# Altium schematic sheet Test_shema.SchDoc
size A4
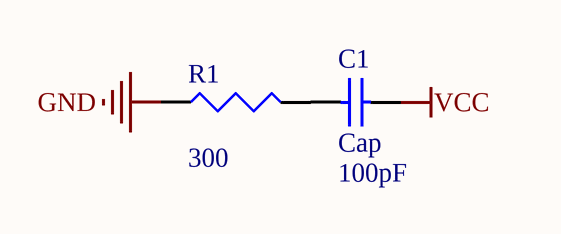
[diagram p0: Test_shema.SchDoc]

## Parts
C1  Cap  value 100pF  [Capacitor 1206]
R1  value 300  [Resistor 1206]

## Nets
GND: R1.1
VCC: C1.2
NetC1_1: C1.1 R1.2

## Library data of the parts
C1 = Cap: Capacitor; Published: 8-Jun-2000; LatestRevisionDate: 17-Jul-2002; LatestRevisionNote: Re-released for DXP Platform.; PackageReference: RAD-0.3; Publisher: Altium Limited; PackageDescription: Radial Cap, Thru-Hole; 2 Leads; 0.3 in Pin Spacing
R1 = Res3: Resistor; Published: 8-Jun-2000; LatestRevisionDate: 29-May-2009; LatestRevisionNote: IPC-7351 Footprint Added.; PackageReference: J1-0603; Publisher: Altium Limited; PackageDescription: Chip Resistor